# Altium schematic sheet CM5 Nas.SchDoc
size 420 x 297 mm
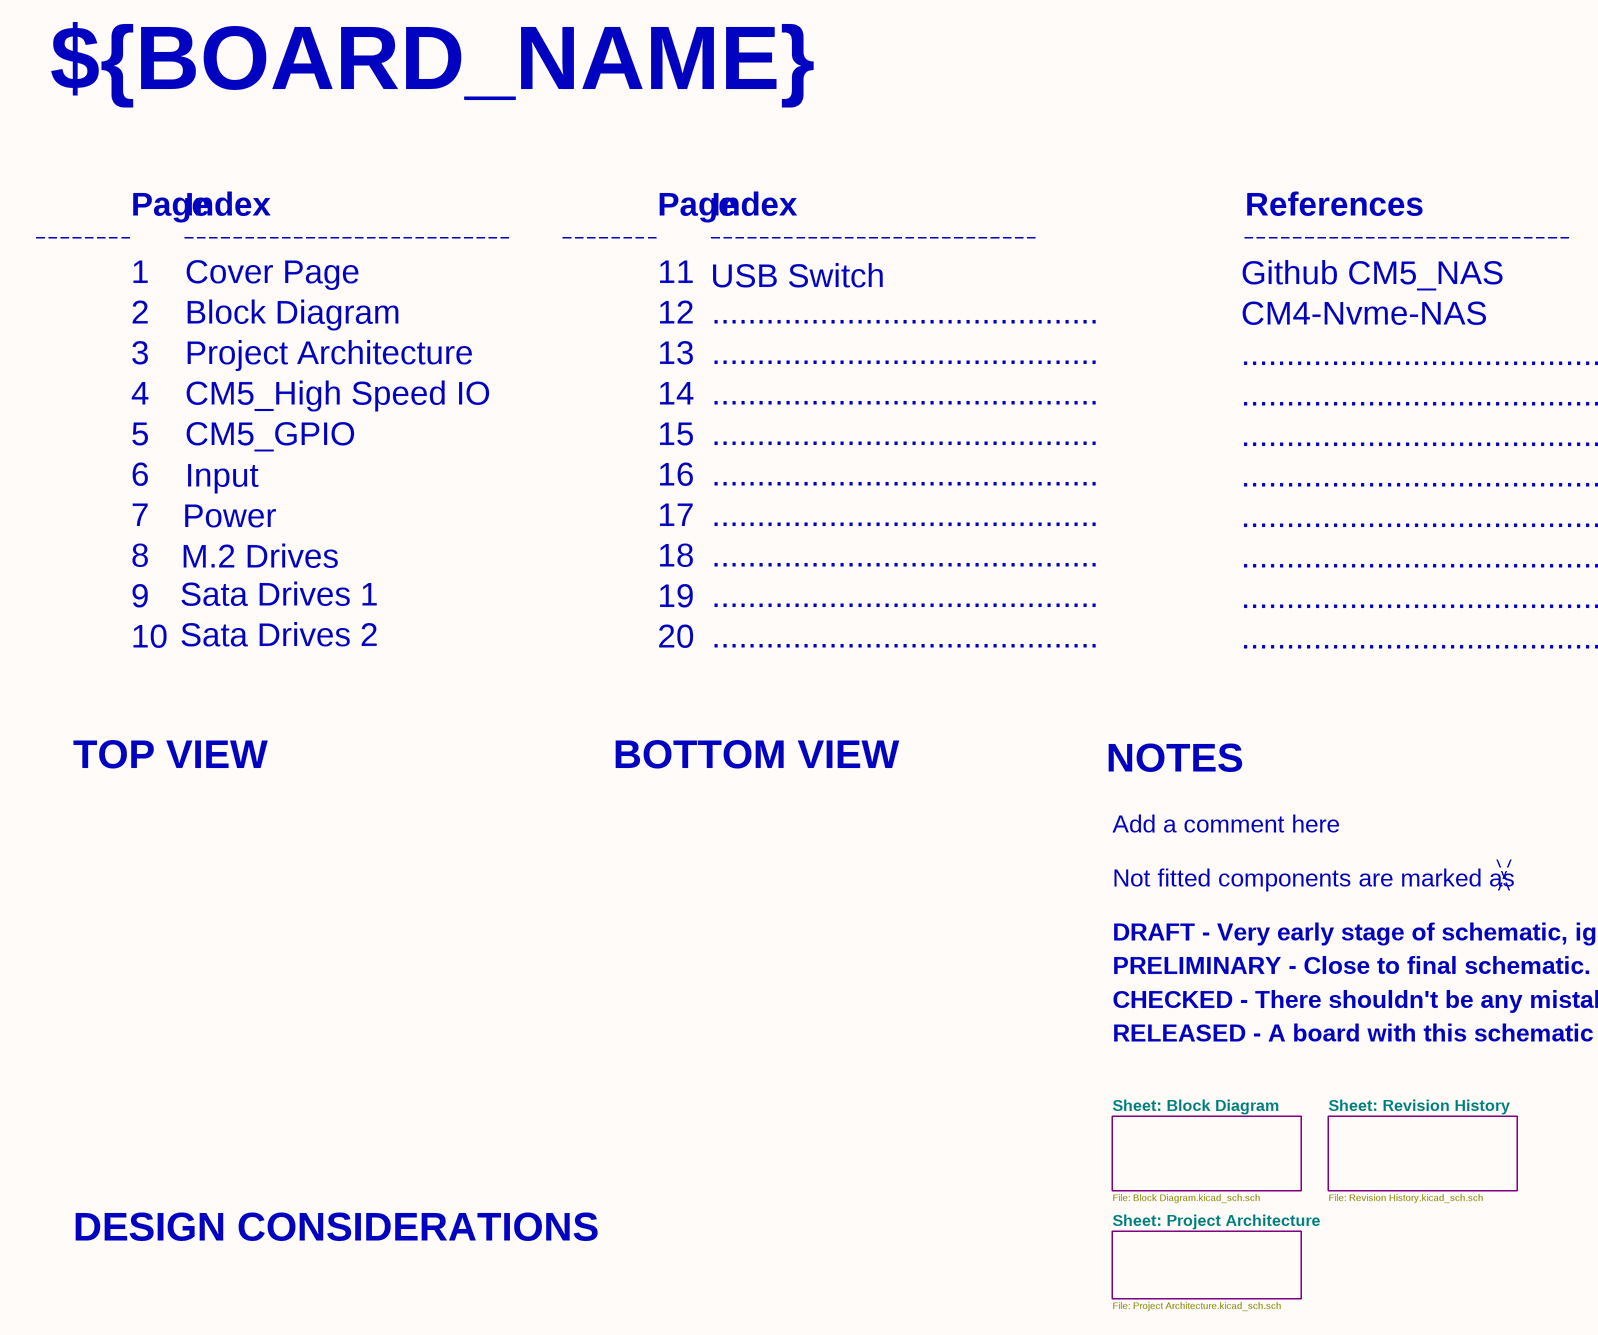
[diagram p0: CM5 Nas.SchDoc, left]
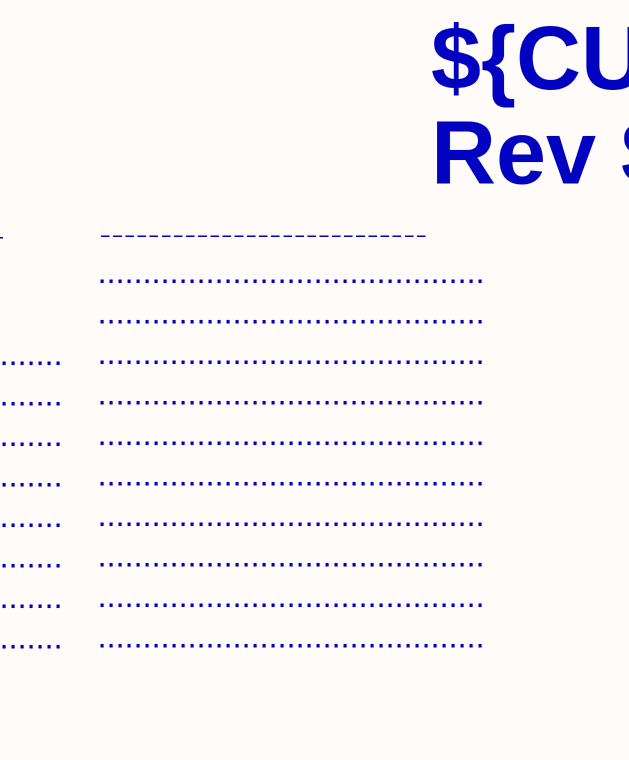
[diagram p1: CM5 Nas.SchDoc, right]

## Sub-sheets
Block Diagram = Block Diagram.SchDoc: no entries
Project Architecture = Project Architecture.SchDoc: no entries
Revision History = Revision History.SchDoc: no entries

## Notes on the sheet
- ${BOARD_NAME}
- ${CURRENT_DATE}
- Page
- Index
- References
- Rev ${REVISION}
- 1
- Cover Page
- 11
- Github CM5_NAS
- ...........................................
- 2
- Block Diagram
- 12
- USB Switch
- CM4-Nvme-NAS
- 3
- 4
- CM5_High Speed IO
- Project Architecture
- 13
- 14
- 6
- 5
- CM5_GPIO
- 15
- 16
- 7
- Power
- Input
- 17
- 9
- 8
- Sata Drives 1
- M.2 Drives
- 18
- 19
- 10
- Sata Drives 2
- 20
- TOP VIEW
- BOTTOM VIEW
- NOTES
- Not fitted components are marked as
- Add a comment here
- DRAFT - Very early stage of schematic, ignore details.
- PRELIMINARY - Close to final schematic.
- CHECKED - There shouldn't be any mistakes. Contact the engineer if you find any.
- RELEASED - A board with this schematic has been sent to production.
- Sheet: Block Diagram
- Sheet: Revision History
- File: Block Diagram.kicad_sch.sch
- Sheet: Project Architecture
- File: Revision History.kicad_sch.sch
- DESIGN CONSIDERATIONS
- File: Project Architecture.kicad_sch.sch
- A
- B
- C
- D
- E
- Title: Cover Page
- File: CM5 Nas.kicad_sch
- Sheet: /
- F
- KiCad E.D.A.  kicad (5.1.4)-1
- Size: A3
- Date: Last Modified Date
- Rev: ${REVISION}
- Id: 1/1